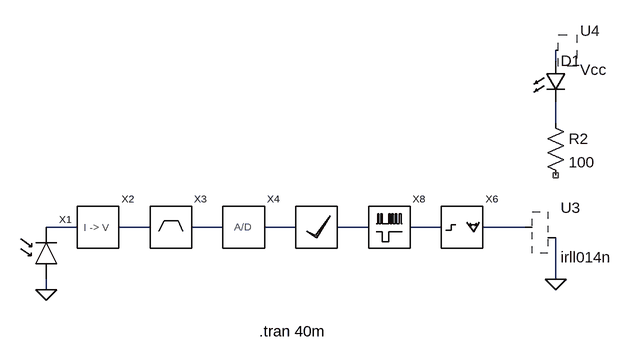
[diagram p0: schematic Magic Box.asc]
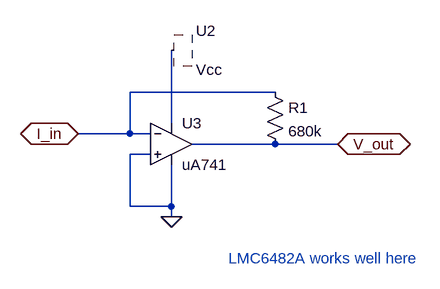
[diagram p1: sub-circuit iv.asc]
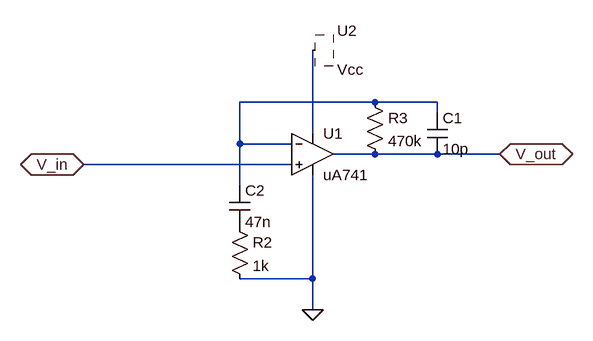
[diagram p2: sub-circuit filtre.asc]
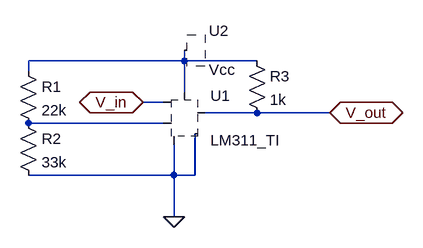
[diagram p3: sub-circuit ad.asc]
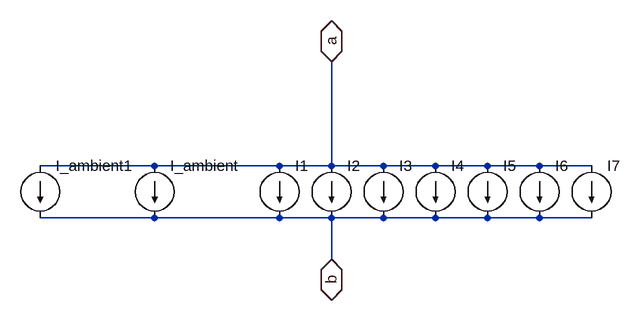
[diagram p4: sub-circuit pdo.asc]
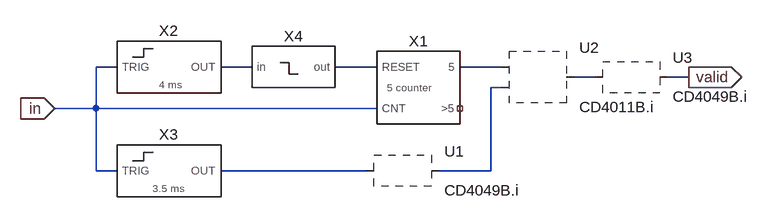
[diagram p5: sub-circuit pulse_validator.asc]
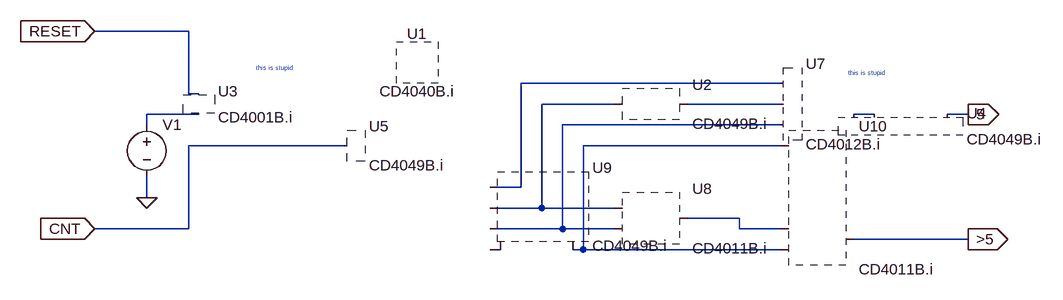
[diagram p6: sub-circuit 5_cnt.asc]
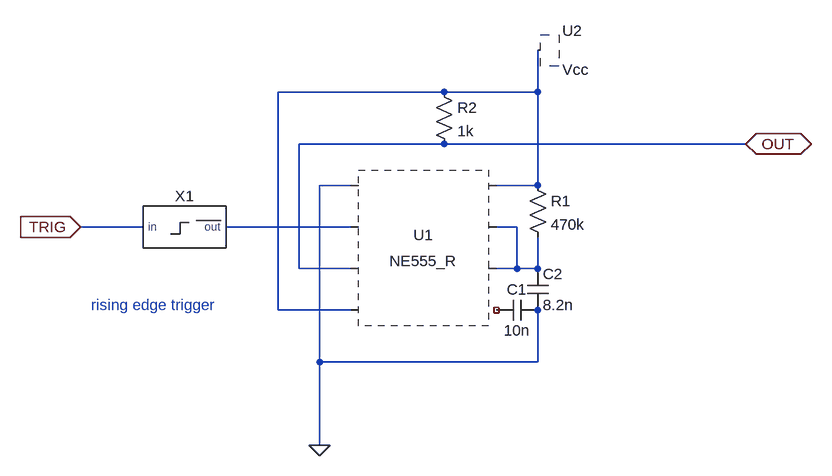
[diagram p7: sub-circuit tim4ms.asc]
Magic Box.asc, the LTspice schematic file:
Version 4
SHEET 1 2732 1608
WIRE 560 -256 560 -272
WIRE 560 -160 560 -192
WIRE -176 0 -224 0
WIRE -64 0 -112 0
WIRE 48 0 0 0
WIRE 160 0 112 0
WIRE 272 0 224 0
WIRE 384 0 336 0
WIRE 512 0 448 0
WIRE 560 80 560 16
WIRE -224 96 -224 80
FLAG 560 80 0
FLAG -224 96 0
SYMBOL IV -144 0 R0
SYMATTR InstName X2
SYMBOL Filtre -32 0 R0
SYMATTR InstName X3
SYMBOL AD 80 0 R0
SYMATTR InstName X4
SYMBOL Vcc 560 -336 R0
SYMATTR InstName U4
SYMBOL PDo -224 32 R0
SYMATTR InstName X1
SYMBOL LED 544 -256 R0
WINDOW 3 48 42 Invisible 2
SYMATTR InstName D1
SYMATTR Value RED
SYMATTR Description Diode
SYMATTR Type diode
SYMBOL Pulse_Validator 192 0 R0
WINDOW 0 0 -32 Invisible 2
SYMATTR InstName X7
SYMBOL ZZZ\\MOS\\irll014n 512 -80 R0
SYMATTR InstName U3
SYMBOL res 544 -176 R0
SYMATTR InstName R2
SYMATTR Value 100
SYMBOL Toggle 416 0 R0
SYMATTR InstName X6
SYMBOL Missing_Pulse_Detector 304 0 R0
SYMATTR InstName X8
TEXT 104 160 Left 2 !.tran 40m

iv.asc, the sub-circuit schematic file:
Version 4
SHEET 1 880 680
WIRE 304 80 80 80
WIRE 144 128 144 16
WIRE 80 144 80 80
WIRE 80 144 0 144
WIRE 112 144 80 144
WIRE 304 160 176 160
WIRE 400 160 304 160
WIRE 112 176 80 176
WIRE 80 256 80 176
WIRE 144 256 144 192
WIRE 144 256 80 256
WIRE 144 272 144 256
FLAG 0 144 I_in
IOPIN 0 144 BiDir
FLAG 400 160 V_out
IOPIN 400 160 BiDir
FLAG 144 272 0
SYMBOL res 288 64 R0
SYMATTR InstName R1
SYMATTR Value 680k
SYMBOL Vcc 144 -48 R0
SYMATTR InstName U2
SYMBOL ValVol\\ST\\OpAmp\\uA741 144 96 R0
SYMATTR InstName U3
TEXT 232 336 Left 2 ;LMC6482A works well here

filtre.asc, the sub-circuit schematic file:
Version 4
SHEET 1 880 680
WIRE 224 96 16 96
WIRE 320 96 224 96
WIRE 320 112 320 96
WIRE 128 144 128 16
WIRE 16 160 16 96
WIRE 96 160 16 160
WIRE 224 176 160 176
WIRE 320 176 224 176
WIRE 416 176 320 176
WIRE 96 192 -224 192
WIRE 16 224 16 160
WIRE 128 368 128 208
WIRE 128 368 16 368
WIRE 128 416 128 368
FLAG 128 416 0
FLAG 416 176 V_out
IOPIN 416 176 BiDir
FLAG -224 192 V_in
IOPIN -224 192 BiDir
SYMBOL res 208 80 R0
SYMATTR InstName R3
SYMATTR Value 470k
SYMBOL Vcc 128 -48 R0
SYMATTR InstName U2
SYMBOL res 0 272 R0
SYMATTR InstName R2
SYMATTR Value 1k
SYMBOL cap 304 112 R0
SYMATTR InstName C1
SYMATTR Value 10p
SYMBOL cap 0 224 R0
SYMATTR InstName C2
SYMATTR Value 47n
SYMBOL ValVol\\ST\\OpAmp\\uA741 128 112 R0
SYMATTR InstName U1

ad.asc, the sub-circuit schematic file:
Version 4
SHEET 1 880 680
WIRE 144 80 144 64
WIRE 144 80 -96 80
WIRE 256 80 144 80
WIRE -96 96 -96 80
WIRE 144 128 144 80
WIRE 112 144 80 144
WIRE 256 160 176 160
WIRE 368 160 256 160
WIRE 112 176 -96 176
WIRE 128 256 128 208
WIRE 128 256 -96 256
WIRE 160 256 160 192
WIRE 160 256 128 256
WIRE 128 320 128 256
FLAG 128 320 0
FLAG 80 144 V_in
IOPIN 80 144 BiDir
FLAG 368 160 V_out
IOPIN 368 160 BiDir
SYMBOL ZZZ\\Comparator\\LM311_TI 144 160 R0
SYMATTR InstName U1
SYMBOL Vcc 144 0 R0
SYMATTR InstName U2
SYMBOL res -112 80 R0
SYMATTR InstName R1
SYMATTR Value 22k
SYMBOL res -112 160 R0
SYMATTR InstName R2
SYMATTR Value 33k
SYMBOL res 240 64 R0
SYMATTR InstName R3
SYMATTR Value 1k

pdo.asc, the sub-circuit schematic file:
Version 4
SHEET 1 880 680
WIRE -64 80 -240 80
WIRE 128 80 -64 80
WIRE 208 80 208 -80
WIRE 208 80 128 80
WIRE 288 80 208 80
WIRE 368 80 288 80
WIRE 448 80 368 80
WIRE 528 80 448 80
WIRE 608 80 528 80
WIRE -64 160 -240 160
WIRE 128 160 -64 160
WIRE 208 160 128 160
WIRE 288 160 208 160
WIRE 368 160 288 160
WIRE 448 160 368 160
WIRE 528 160 448 160
WIRE 608 160 528 160
WIRE 208 224 208 160
FLAG 208 -80 a
IOPIN 208 -80 BiDir
FLAG 208 224 b
IOPIN 208 224 BiDir
SYMBOL current 128 80 R0
WINDOW 3 24 80 Invisible 2
WINDOW 123 0 0 Left 0
WINDOW 39 0 0 Left 0
SYMATTR Value PULSE(0 100n 1m 4.5u 7u 50u 500u 5)
SYMATTR InstName I1
SYMBOL current 208 80 R0
WINDOW 3 24 80 Invisible 2
WINDOW 123 0 0 Left 0
WINDOW 39 0 0 Left 0
SYMATTR Value PULSE(0 100n 6m 4.5u 7u 50u 500u 5)
SYMATTR InstName I2
SYMBOL current 288 80 R0
WINDOW 3 24 80 Invisible 2
WINDOW 123 0 0 Left 0
WINDOW 39 0 0 Left 0
SYMATTR Value PULSE(0 100n 11m 4.5u 7u 50u 500u 7)
SYMATTR InstName I3
SYMBOL current -64 80 R0
WINDOW 3 24 80 Invisible 2
WINDOW 123 0 0 Left 0
WINDOW 39 0 0 Left 0
SYMATTR Value SINE(500n 25n 100 0 0 0 10)
SYMATTR InstName I_ambient
SYMBOL current 368 80 R0
WINDOW 3 24 80 Invisible 2
WINDOW 123 0 0 Left 0
WINDOW 39 0 0 Left 0
SYMATTR Value PULSE(0 0 16m 4.5u 7u 50u 500u 7)
SYMATTR InstName I4
SYMBOL current 448 80 R0
WINDOW 3 24 80 Invisible 2
WINDOW 123 0 0 Left 0
WINDOW 39 0 0 Left 0
SYMATTR Value PULSE(0 100n 21m 4.5u 7u 50u 500u 5)
SYMATTR InstName I5
SYMBOL current 528 80 R0
WINDOW 3 24 80 Invisible 2
WINDOW 123 0 0 Left 0
WINDOW 39 0 0 Left 0
SYMATTR Value PULSE(0 100n 26m 4.5u 7u 50u 500u 5)
SYMATTR InstName I6
SYMBOL current 608 80 R0
WINDOW 3 24 80 Invisible 2
WINDOW 123 0 0 Left 0
WINDOW 39 0 0 Left 0
SYMATTR Value PULSE(0 100n 31m 4.5u 7u 50u 500u 5)
SYMATTR InstName I7
SYMBOL current -240 80 R0
WINDOW 3 24 80 Invisible 2
WINDOW 123 0 0 Left 0
WINDOW 39 0 0 Left 0
SYMATTR Value SINE(0 10n 273 0 0 0 10)
SYMATTR InstName I_ambient1

pulse_validator.asc, the sub-circuit schematic file:
Version 4
SHEET 1 880 680
WIRE -528 160 -560 160
WIRE -320 160 -368 160
WIRE -128 160 -192 160
WIRE 64 160 0 160
WIRE 208 176 176 176
WIRE 352 176 320 176
WIRE 64 192 48 192
WIRE -560 224 -560 160
WIRE -560 224 -624 224
WIRE -128 224 -560 224
WIRE -560 320 -560 224
WIRE -528 320 -560 320
WIRE -144 320 -368 320
WIRE 48 320 48 192
WIRE 48 320 -32 320
FLAG -624 224 in
IOPIN -624 224 In
FLAG 352 176 valid
IOPIN 352 176 Out
SYMBOL ZZZ\\LOGIC\\CD4xxx\\CD4049B.i -96 272 R0
SYMATTR InstName U1
SYMBOL ZZZ\\LOGIC\\CD4xxx\\CD4011B.i 112 112 R0
SYMATTR InstName U2
SYMBOL 5_cnt -64 176 R0
SYMATTR InstName X1
SYMBOL TIM4ms -448 160 R0
SYMATTR InstName X2
SYMBOL TIM3.5ms -448 320 R0
SYMATTR InstName X3
SYMBOL falling_edge -256 144 R0
SYMATTR InstName X4
SYMBOL ZZZ\\LOGIC\\CD4xxx\\CD4049B.i 256 128 R0
SYMATTR InstName U3

5_cnt.asc, the sub-circuit schematic file:
Version 4
SHEET 1 988 680
WIRE -304 -112 -448 -112
WIRE 608 -32 208 -32
WIRE -304 -16 -304 -112
WIRE -288 -16 -304 -16
WIRE 352 0 240 0
WIRE 608 0 464 0
WIRE -288 16 -368 16
WIRE 752 16 720 16
WIRE 896 16 864 16
WIRE -368 32 -368 16
WIRE 608 32 272 32
WIRE -64 64 -304 64
WIRE 608 64 304 64
WIRE 208 128 208 -32
WIRE 208 128 160 128
WIRE -368 144 -368 112
WIRE 240 160 240 0
WIRE 240 160 160 160
WIRE 352 160 240 160
WIRE 544 176 464 176
WIRE -304 192 -304 64
WIRE -304 192 -448 192
WIRE 272 192 272 32
WIRE 272 192 160 192
WIRE 352 192 272 192
WIRE 544 192 544 176
WIRE 608 192 544 192
WIRE 896 208 720 208
WIRE 176 224 160 224
WIRE 304 224 304 64
WIRE 304 224 288 224
WIRE 608 224 304 224
FLAG -448 -112 RESET
IOPIN -448 -112 In
FLAG -448 192 CNT
IOPIN -448 192 In
FLAG 896 16 5
IOPIN 896 16 Out
FLAG 896 208 >5
IOPIN 896 208 Out
FLAG -368 144 0
SYMBOL ZZZ\\LOGIC\\CD4xxx\\CD4040B.i 48 -64 R0
SYMATTR InstName U1
SYMBOL ZZZ\\LOGIC\\CD4xxx\\CD4049B.i 400 -48 R0
SYMATTR InstName U2
SYMBOL ZZZ\\LOGIC\\CD4xxx\\CD4012B.i 656 -80 R0
SYMATTR InstName U7
SYMBOL ZZZ\\LOGIC\\CD4xxx\\CD4011B.i 400 112 R0
SYMATTR InstName U8
SYMBOL ZZZ\\LOGIC\\CD4xxx\\CD4049B.i 224 176 R0
SYMATTR InstName U9
SYMBOL ZZZ\\LOGIC\\CD4xxx\\CD4011B.i 656 144 R0
SYMATTR InstName U10
SYMBOL ZZZ\\LOGIC\\CD4xxx\\CD4049B.i 800 -32 R0
SYMATTR InstName U4
SYMBOL ZZZ\\LOGIC\\CD4xxx\\CD4001B.i -240 -64 R0
SYMATTR InstName U3
SYMBOL ZZZ\\LOGIC\\CD4xxx\\CD4049B.i -128 -48 R0
SYMATTR InstName U5
SYMBOL voltage -368 16 R0
WINDOW 3 24 96 Invisible 2
WINDOW 123 0 0 Left 0
WINDOW 39 0 0 Left 0
SYMATTR Value PULSE(0 5 10n 10n 10n 100n 1 1)
SYMATTR InstName V1
TEXT -200 -56 Left 0 ;this is stupid
TEXT 712 -48 Left 0 ;this is stupid

tim4ms.asc, the sub-circuit schematic file:
Version 4
SHEET 1 880 680
WIRE 208 -80 -48 -80
WIRE 352 -80 352 -144
WIRE 352 -80 208 -80
WIRE 208 0 -16 0
WIRE 672 0 208 0
WIRE 64 64 16 64
WIRE 352 64 352 -80
WIRE 352 64 288 64
WIRE -256 128 -352 128
WIRE 64 128 -128 128
WIRE 320 128 288 128
WIRE -16 192 -16 0
WIRE 64 192 -16 192
WIRE 320 192 320 128
WIRE 320 192 288 192
WIRE 352 192 352 144
WIRE 352 192 320 192
WIRE -48 256 -48 -80
WIRE 64 256 -48 256
WIRE 16 336 16 64
WIRE 352 336 352 256
WIRE 352 336 16 336
WIRE 16 464 16 336
FLAG 16 464 0
FLAG -352 128 TRIG
IOPIN -352 128 In
FLAG 672 0 OUT
IOPIN 672 0 BiDir
SYMBOL ZZZ\\TIMER\\NE555_R 176 160 R0
SYMATTR InstName U1
SYMBOL cap 352 240 R90
WINDOW 0 0 32 VBottom 2
WINDOW 3 32 32 VTop 2
SYMATTR InstName C1
SYMATTR Value 10n
SYMBOL cap 336 192 R0
SYMATTR InstName C2
SYMATTR Value 8.2n
SYMBOL res 336 48 R0
SYMATTR InstName R1
SYMATTR Value 470k
SYMBOL res 192 -96 R0
SYMATTR InstName R2
SYMATTR Value 1k
SYMBOL Vcc 352 -208 R0
SYMATTR InstName U2
SYMBOL Rising_Edge -192 112 R0
SYMATTR InstName X1
TEXT -336 248 Left 2 ;rising edge trigger

rising_edge.asc, the sub-circuit schematic file:
Version 4
SHEET 1 880 680
WIRE 208 160 96 160
WIRE 400 176 320 176
WIRE 96 192 96 160
WIRE 96 192 -16 192
FLAG -16 192 in
IOPIN -16 192 In
FLAG 400 176 out
IOPIN 400 176 Out
SYMBOL ZZZ\\LOGIC\\CD4xxx\\CD4049B.i 144 144 R0
SYMATTR InstName U1
SYMBOL ZZZ\\LOGIC\\CD4xxx\\CD4011B.i 256 112 R0
SYMATTR InstName U2

tim3.5ms.asc, the sub-circuit schematic file:
Version 4
SHEET 1 880 680
WIRE 208 -80 -48 -80
WIRE 352 -80 352 -144
WIRE 352 -80 208 -80
WIRE 208 0 -16 0
WIRE 672 0 208 0
WIRE 64 64 16 64
WIRE 352 64 352 -80
WIRE 352 64 288 64
WIRE -256 128 -352 128
WIRE 64 128 -128 128
WIRE 320 128 288 128
WIRE -16 192 -16 0
WIRE 64 192 -16 192
WIRE 320 192 320 128
WIRE 320 192 288 192
WIRE 352 192 352 144
WIRE 352 192 320 192
WIRE -48 256 -48 -80
WIRE 64 256 -48 256
WIRE 16 336 16 64
WIRE 352 336 352 256
WIRE 352 336 16 336
WIRE 16 464 16 336
FLAG 16 464 0
FLAG -352 128 TRIG
IOPIN -352 128 In
FLAG 672 0 OUT
IOPIN 672 0 BiDir
SYMBOL ZZZ\\TIMER\\NE555_R 176 160 R0
SYMATTR InstName U1
SYMBOL cap 352 240 R90
WINDOW 0 0 32 VBottom 2
WINDOW 3 32 32 VTop 2
SYMATTR InstName C1
SYMATTR Value 10n
SYMBOL cap 336 192 R0
SYMATTR InstName C2
SYMATTR Value 10n
SYMBOL res 336 48 R0
SYMATTR InstName R1
SYMATTR Value 330k
SYMBOL res 192 -96 R0
SYMATTR InstName R2
SYMATTR Value 1k
SYMBOL Vcc 352 -208 R0
SYMATTR InstName U2
SYMBOL Rising_Edge -192 112 R0
SYMATTR InstName X1
TEXT -336 248 Left 2 ;rising edge trigger

falling_edge.asc, the sub-circuit schematic file:
Version 4
SHEET 1 880 680
WIRE 208 160 96 160
WIRE 336 176 320 176
WIRE 464 176 448 176
WIRE 96 192 96 160
FLAG -16 192 in
IOPIN -16 192 In
FLAG 464 176 out
IOPIN 464 176 Out
SYMBOL ZZZ\\LOGIC\\CD4xxx\\CD4049B.i 144 144 R0
SYMATTR InstName U1
SYMBOL ZZZ\\LOGIC\\CD4xxx\\CD4011B.i 256 112 R0
SYMATTR InstName U2
SYMBOL ZZZ\\LOGIC\\CD4xxx\\CD4049B.i 32 144 R0
SYMATTR InstName U3
SYMBOL ZZZ\\LOGIC\\CD4xxx\\CD4049B.i 384 128 R0
SYMATTR InstName U4

toggle.asc, the sub-circuit schematic file:
Version 4
SHEET 1 880 680
WIRE 96 80 64 80
WIRE 32 112 32 48
WIRE 96 112 32 112
WIRE 448 112 288 112
WIRE 96 144 -96 144
WIRE 32 176 32 112
WIRE 96 176 32 176
WIRE 64 208 64 80
WIRE 96 208 64 208
WIRE 64 272 64 208
FLAG 64 272 0
FLAG -96 144 T
IOPIN -96 144 In
FLAG 448 112 Q
IOPIN 448 112 Out
SYMBOL ZZZ\\LOGIC\\CD4xxx\\CD4027B.i 192 16 R0
SYMATTR InstName U1
SYMBOL Vcc 32 -16 R0
SYMATTR InstName U2

missing_pulse_detector.asc, the sub-circuit schematic file:
Version 4
SHEET 1 880 680
WIRE -32 -32 -144 -32
WIRE 320 -32 -32 -32
WIRE 496 0 -336 0
WIRE -144 32 -144 -32
WIRE 0 64 -64 64
WIRE 320 64 320 -32
WIRE 320 64 224 64
WIRE 320 96 320 64
WIRE -336 128 -336 0
WIRE -336 128 -368 128
WIRE -320 128 -336 128
WIRE 0 128 -208 128
WIRE 256 128 224 128
WIRE -144 192 -144 112
WIRE -144 192 -368 192
WIRE 0 192 -144 192
WIRE 256 192 256 128
WIRE 256 192 224 192
WIRE 320 192 320 176
WIRE 320 192 256 192
WIRE 416 192 320 192
WIRE 320 208 320 192
WIRE -32 256 -32 -32
WIRE 0 256 -32 256
WIRE 256 256 224 256
WIRE 496 272 496 0
WIRE 496 272 464 272
WIRE -64 320 -64 64
WIRE 256 320 -64 320
WIRE 320 320 320 272
WIRE 320 320 256 320
WIRE 416 320 416 288
WIRE 416 320 320 320
WIRE 320 352 320 320
FLAG 320 352 0
FLAG -368 128 Trig
IOPIN -368 128 In
FLAG -368 192 Out
IOPIN -368 192 Out
SYMBOL ZZZ\\TIMER\\NE555_R 112 160 R0
SYMATTR InstName U1
SYMBOL ZZZ\\LOGIC\\CD4xxx\\CD4049B.i -272 80 R0
SYMATTR InstName U2
SYMBOL ZZZ\\MOS\\irll014n 464 192 M0
SYMATTR InstName U3
SYMBOL cap 240 256 R0
SYMATTR InstName C1
SYMATTR Value 10n
SYMBOL cap 304 208 R0
SYMATTR InstName C2
SYMATTR Value 100n
SYMBOL res 304 80 R0
SYMATTR InstName R1
SYMATTR Value 82k
SYMBOL Vcc 320 -96 R0
SYMATTR InstName U4
SYMBOL res -160 16 R0
SYMATTR InstName R2
SYMATTR Value 1k

The netlist it stands for:
* Magic Box.asc
XX2 N003 N004 iv
XX3 N004 N005 filtre
XX4 N005 N006 ad
* U4: Vcc (symbol Vcc not available, pin order unknown); nets seen at it: N001
XX1 N003 0 pdo
D1 N001 N002 RED
XX7 N006 N007 pulse_validator
* U3: irll014n (symbol ZZZ\MOS\irll014n not available, pin order unknown); nets seen at it: 0, N009
R2 N002 NC_01 100
XX6 N008 N009 toggle
XX8 N007 N008 missing_pulse_detector

* block symbol definitions
.subckt iv I_in V_out
R1 I_in V_out 680k
* U2: Vcc (symbol Vcc not available, pin order unknown); nets seen at it: N001
* U3: uA741 (symbol ValVol\ST\OpAmp\uA741 not available, pins judged from their places): In+=0 In-=I_in V+=N001 V-=0 OUT=V_out
* LMC6482A works well here
.ends iv

.subckt filtre V_in V_out
R3 N001 V_out 470k
* U2: Vcc (symbol Vcc not available, pin order unknown); nets seen at it: N002
R2 P001 0 1k
C1 N001 V_out 10p
C2 N001 P001 47n
* U1: uA741 (symbol ValVol\ST\OpAmp\uA741 not available, pins judged from their places): In+=V_in In-=N001 V+=N002 V-=0 OUT=V_out
.ends filtre

.subckt ad V_in V_out
* U1: LM311_TI (symbol ZZZ\Comparator\LM311_TI not available, pin order unknown); nets seen at it: 0, N001, N002, V_in, V_out
* U2: Vcc (symbol Vcc not available, pin order unknown); nets seen at it: N001
R1 N001 N002 22k
R2 N002 0 33k
R3 N001 V_out 1k
.ends ad

.subckt pdo a b
I1 a b PULSE(0 100n 1m 4.5u 7u 50u 500u 5)
I2 a b PULSE(0 100n 6m 4.5u 7u 50u 500u 5)
I3 a b PULSE(0 100n 11m 4.5u 7u 50u 500u 7)
I_ambient a b SINE(500n 25n 100 0 0 0 10)
I4 a b PULSE(0 0 16m 4.5u 7u 50u 500u 7)
I5 a b PULSE(0 100n 21m 4.5u 7u 50u 500u 5)
I6 a b PULSE(0 100n 26m 4.5u 7u 50u 500u 5)
I7 a b PULSE(0 100n 31m 4.5u 7u 50u 500u 5)
I_ambient1 a b SINE(0 10n 273 0 0 0 10)
.ends pdo

.subckt pulse_validator in valid
* U1: CD4049B.i (symbol ZZZ\LOGIC\CD4xxx\CD4049B.i not available, pin order unknown); nets seen at it: N005, N006
* U2: CD4011B.i (symbol ZZZ\LOGIC\CD4xxx\CD4011B.i not available, pin order unknown); nets seen at it: N003, N004, N005
XX1 in N002 N003 NC_01 5_cnt
XX2 N001 in tim4ms
XX3 N006 in tim3.5ms
XX4 N001 N002 falling_edge
* U3: CD4049B.i (symbol ZZZ\LOGIC\CD4xxx\CD4049B.i not available, pin order unknown); nets seen at it: N004, valid
.ends pulse_validator

.subckt 5_cnt CNT RESET 5 >5
* U1: CD4040B.i (symbol ZZZ\LOGIC\CD4xxx\CD4040B.i not available, pin order unknown); nets seen at it: 
* U2: CD4049B.i (symbol ZZZ\LOGIC\CD4xxx\CD4049B.i not available, pin order unknown); nets seen at it: N002, N003
* U7: CD4012B.i (symbol ZZZ\LOGIC\CD4xxx\CD4012B.i not available, pin order unknown); nets seen at it: N001, N003, N006
* U8: CD4011B.i (symbol ZZZ\LOGIC\CD4xxx\CD4011B.i not available, pin order unknown); nets seen at it: N002, N006, N008
* U9: CD4049B.i (symbol ZZZ\LOGIC\CD4xxx\CD4049B.i not available, pin order unknown); nets seen at it: N001, N002, N006, N007, N009
* U10: CD4011B.i (symbol ZZZ\LOGIC\CD4xxx\CD4011B.i not available, pin order unknown); nets seen at it: >5, N007, N008
* U4: CD4049B.i (symbol ZZZ\LOGIC\CD4xxx\CD4049B.i not available, pin order unknown); nets seen at it: 5, N005
* U3: CD4001B.i (symbol ZZZ\LOGIC\CD4xxx\CD4001B.i not available, pin order unknown); nets seen at it: N004, RESET
* U5: CD4049B.i (symbol ZZZ\LOGIC\CD4xxx\CD4049B.i not available, pin order unknown); nets seen at it: CNT
V1 N004 0 PULSE(0 5 10n 10n 10n 100n 1 1)
* this is stupid
* this is stupid
.ends 5_cnt

.subckt tim4ms OUT TRIG
* U1: NE555_R (symbol ZZZ\TIMER\NE555_R not available, pin order unknown); nets seen at it: 0, N001, N002, N003, OUT
C1 0 NC_01 10n
C2 N003 0 8.2n
R1 N001 N003 470k
R2 N001 OUT 1k
* U2: Vcc (symbol Vcc not available, pin order unknown); nets seen at it: N001
XX1 TRIG N002 rising_edge
* rising edge trigger
.ends tim4ms

.subckt rising_edge in out
* U1: CD4049B.i (symbol ZZZ\LOGIC\CD4xxx\CD4049B.i not available, pin order unknown); nets seen at it: in
* U2: CD4011B.i (symbol ZZZ\LOGIC\CD4xxx\CD4011B.i not available, pin order unknown); nets seen at it: out
.ends rising_edge

.subckt tim3.5ms OUT TRIG
* U1: NE555_R (symbol ZZZ\TIMER\NE555_R not available, pin order unknown); nets seen at it: 0, N001, N002, N003, OUT
C1 0 NC_01 10n
C2 N003 0 10n
R1 N001 N003 330k
R2 N001 OUT 1k
* U2: Vcc (symbol Vcc not available, pin order unknown); nets seen at it: N001
XX1 TRIG N002 rising_edge
* rising edge trigger
.ends tim3.5ms

.subckt falling_edge in out
* U1: CD4049B.i (symbol ZZZ\LOGIC\CD4xxx\CD4049B.i not available, pin order unknown); nets seen at it: N001
* U2: CD4011B.i (symbol ZZZ\LOGIC\CD4xxx\CD4011B.i not available, pin order unknown); nets seen at it: 
* U3: CD4049B.i (symbol ZZZ\LOGIC\CD4xxx\CD4049B.i not available, pin order unknown); nets seen at it: in
* U4: CD4049B.i (symbol ZZZ\LOGIC\CD4xxx\CD4049B.i not available, pin order unknown); nets seen at it: N002, out
.ends falling_edge

.subckt toggle T Q
* U1: CD4027B.i (symbol ZZZ\LOGIC\CD4xxx\CD4027B.i not available, pin order unknown); nets seen at it: 0, N001, Q, T
* U2: Vcc (symbol Vcc not available, pin order unknown); nets seen at it: N001
.ends toggle

.subckt missing_pulse_detector Trig Out
* U1: NE555_R (symbol ZZZ\TIMER\NE555_R not available, pin order unknown); nets seen at it: 0, N001, N002, N003, N004, Out
* U2: CD4049B.i (symbol ZZZ\LOGIC\CD4xxx\CD4049B.i not available, pin order unknown); nets seen at it: N002, Trig
* U3: irll014n (symbol ZZZ\MOS\irll014n not available, pin order unknown); nets seen at it: 0, N003, Trig
C1 N004 0 10n
C2 N003 0 100n
R1 N001 N003 82k
* U4: Vcc (symbol Vcc not available, pin order unknown); nets seen at it: 
R2 N001 Out 1k
.ends missing_pulse_detector

.model D D
.lib standard.dio
.tran 40m
.backanno
.end